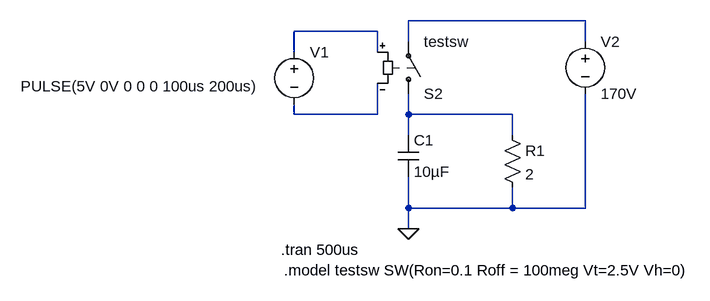
[diagram p0: schematic storage cap discharge test.asc]
storage cap discharge test.asc, the LTspice schematic file:
Version 4
SHEET 1 880 680
WIRE 448 -48 176 -48
WIRE 128 -32 0 -32
WIRE 176 -16 176 -48
WIRE 448 -16 448 -48
WIRE 0 0 0 -32
WIRE 128 0 128 -32
WIRE 0 96 0 80
WIRE 128 96 128 48
WIRE 128 96 0 96
WIRE 176 96 176 64
WIRE 336 96 176 96
WIRE 176 128 176 96
WIRE 336 128 336 96
WIRE 176 240 176 192
WIRE 336 240 336 208
WIRE 336 240 176 240
WIRE 448 240 448 64
WIRE 448 240 336 240
WIRE 176 272 176 240
FLAG 176 272 0
SYMBOL cap 160 128 R0
SYMATTR InstName C1
SYMATTR Value 10µF
SYMBOL res 320 112 R0
SYMATTR InstName R1
SYMATTR Value 2
SYMBOL voltage 0 -16 R0
WINDOW 3 -421 69 Left 2
WINDOW 123 0 0 Left 0
WINDOW 39 0 0 Left 0
SYMATTR InstName V1
SYMATTR Value PULSE(5V 0V 0 0 0 100us 200us)
SYMBOL voltage 448 -32 R0
WINDOW 123 0 0 Left 0
WINDOW 39 0 0 Left 0
SYMATTR InstName V2
SYMATTR Value 170V
SYMBOL sw 176 80 M180
SYMATTR InstName S2
SYMATTR Value testsw
TEXT -20 304 Left 2 !.tran 500us
TEXT -16 336 Left 2 !.model testsw SW(Ron=0.1 Roff = 100meg Vt=2.5V Vh=0)

The netlist it stands for:
* storage cap discharge test.asc
C1 N004 0 10µF
R1 N004 0 2
V1 N002 N003 PULSE(5V 0V 0 0 0 100us 200us)
V2 N001 0 170V
S2 N004 N001 N002 N003 testsw
.tran 500us
.model testsw SW(Ron=0.1 Roff = 100meg Vt=2.5V Vh=0)
.backanno
.end